# Altium schematic sheet dualinv.SchDoc
size A; SheetNumber: 9; SheetTotal: 9
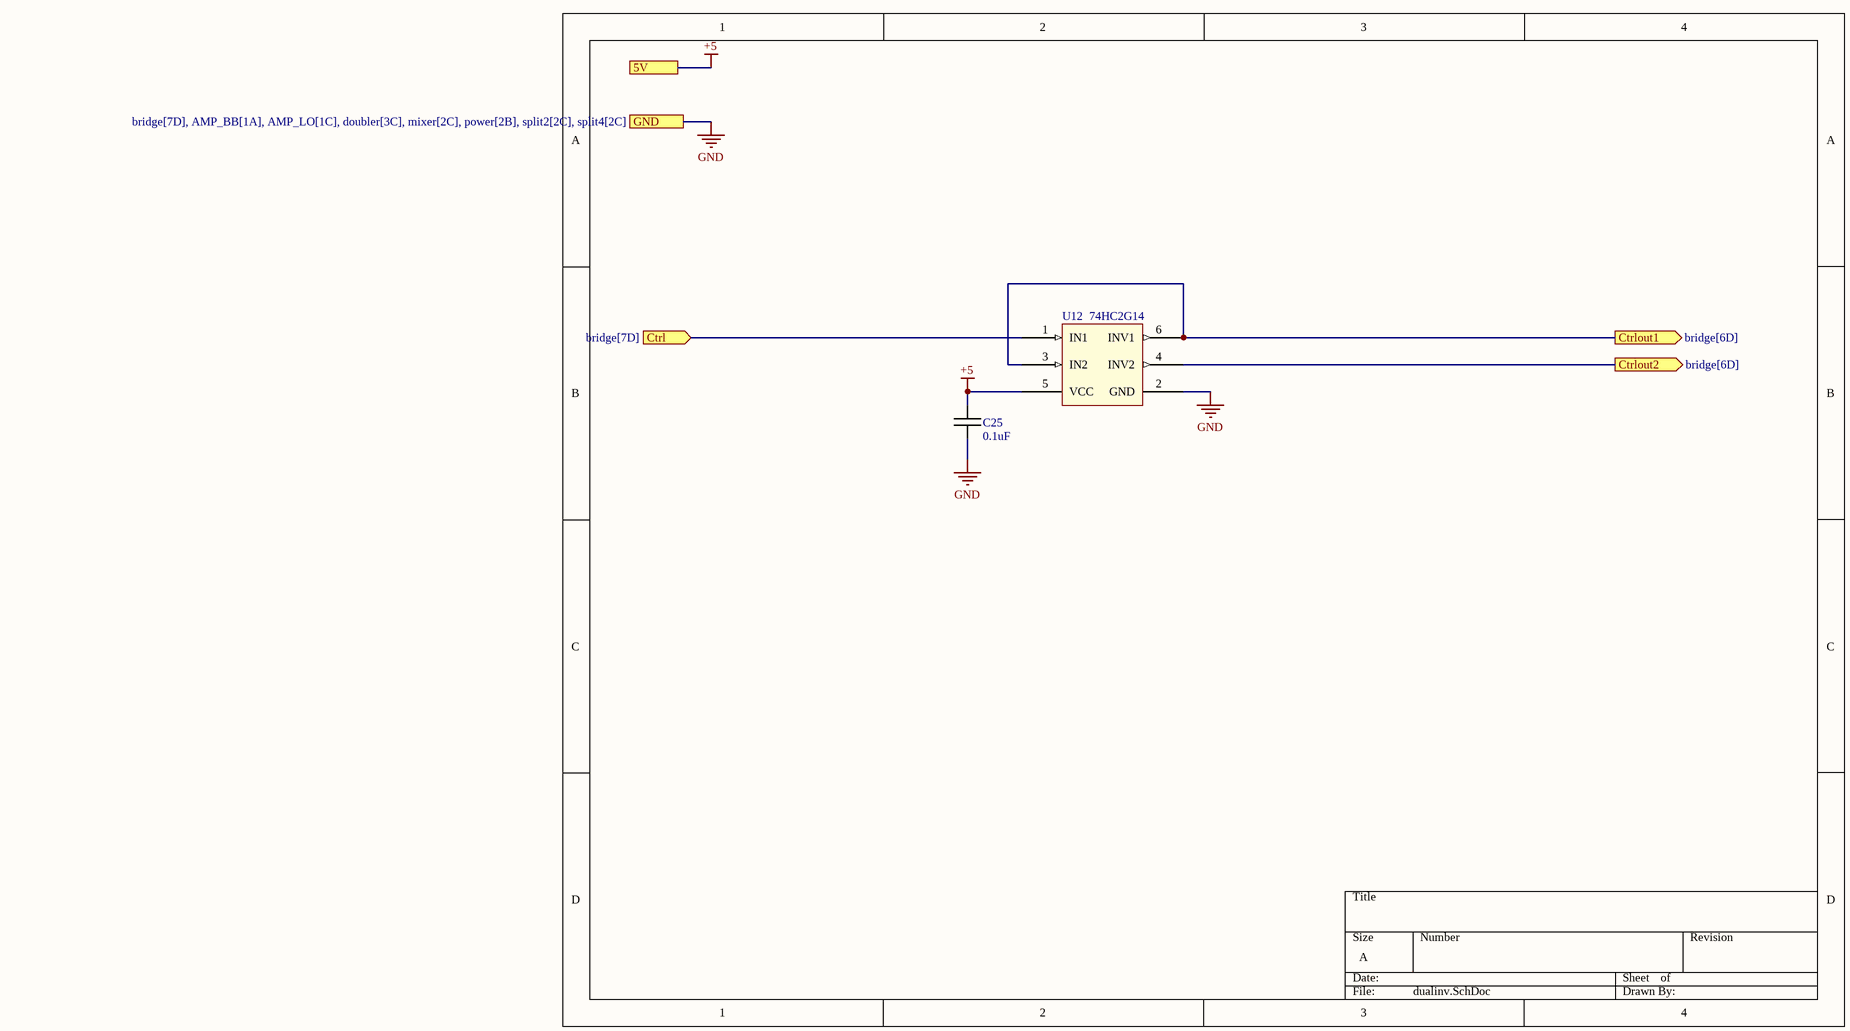
[diagram p0: dualinv.SchDoc]

## Parts
C25  0.1uF  [CAPC1608X90N]
U12  74HC2G14  [TSOP-6]

## Ports
5V (see bridge[7D], AMP_BB[1A], AMP_LO[3A], doubler[2B], power[2B]), Ctrl (in, see bridge[7D]), Ctrlout1 (out, see bridge[6D]), Ctrlout2 (out, see bridge[6D]), GND (see bridge[7D], AMP_BB[1A], AMP_LO[1C], doubler[3C], mixer[2C], power[2B], split2[2C], split4[2C])

## Nets
+5: C25.2 U12.5(VCC) ; port 5V
GND: C25.1 U12.2(GND) ; port GND
Ctrl: U12.1(IN1) ; port Ctrl
Ctrlout1: U12.3(IN2) U12.6(INV1) ; port Ctrlout1
Ctrlout2: U12.4(INV2) ; port Ctrlout2

## Library data of the parts
C25 = GCM188L81H104KA57D: SMD Capacitor X8L(MURATA) with Capacitance: 0.10uF Tol. 10%. Rated Voltage: 50Vdc; Supplier 1: Mouser; Supplier Part Number 1: 81-GCM188L81H104KA7D; Manufacturer: Murata; Part Number: GCM188L81H104KA57D
U12 = 74HC2G14: Inverters Dual inverting Schmitt trigger, 2CH; Part Number: 74HC2G14GV; Manufacturer: Nexperia; Supplier 1: Digikey; Supplier Part Number 1: 1727-74HC2G14GV-Q100HCT-ND